# Altium schematic sheet 04_Connector.SchDoc
size A4; SheetNumber: 4; SheetTotal: 4
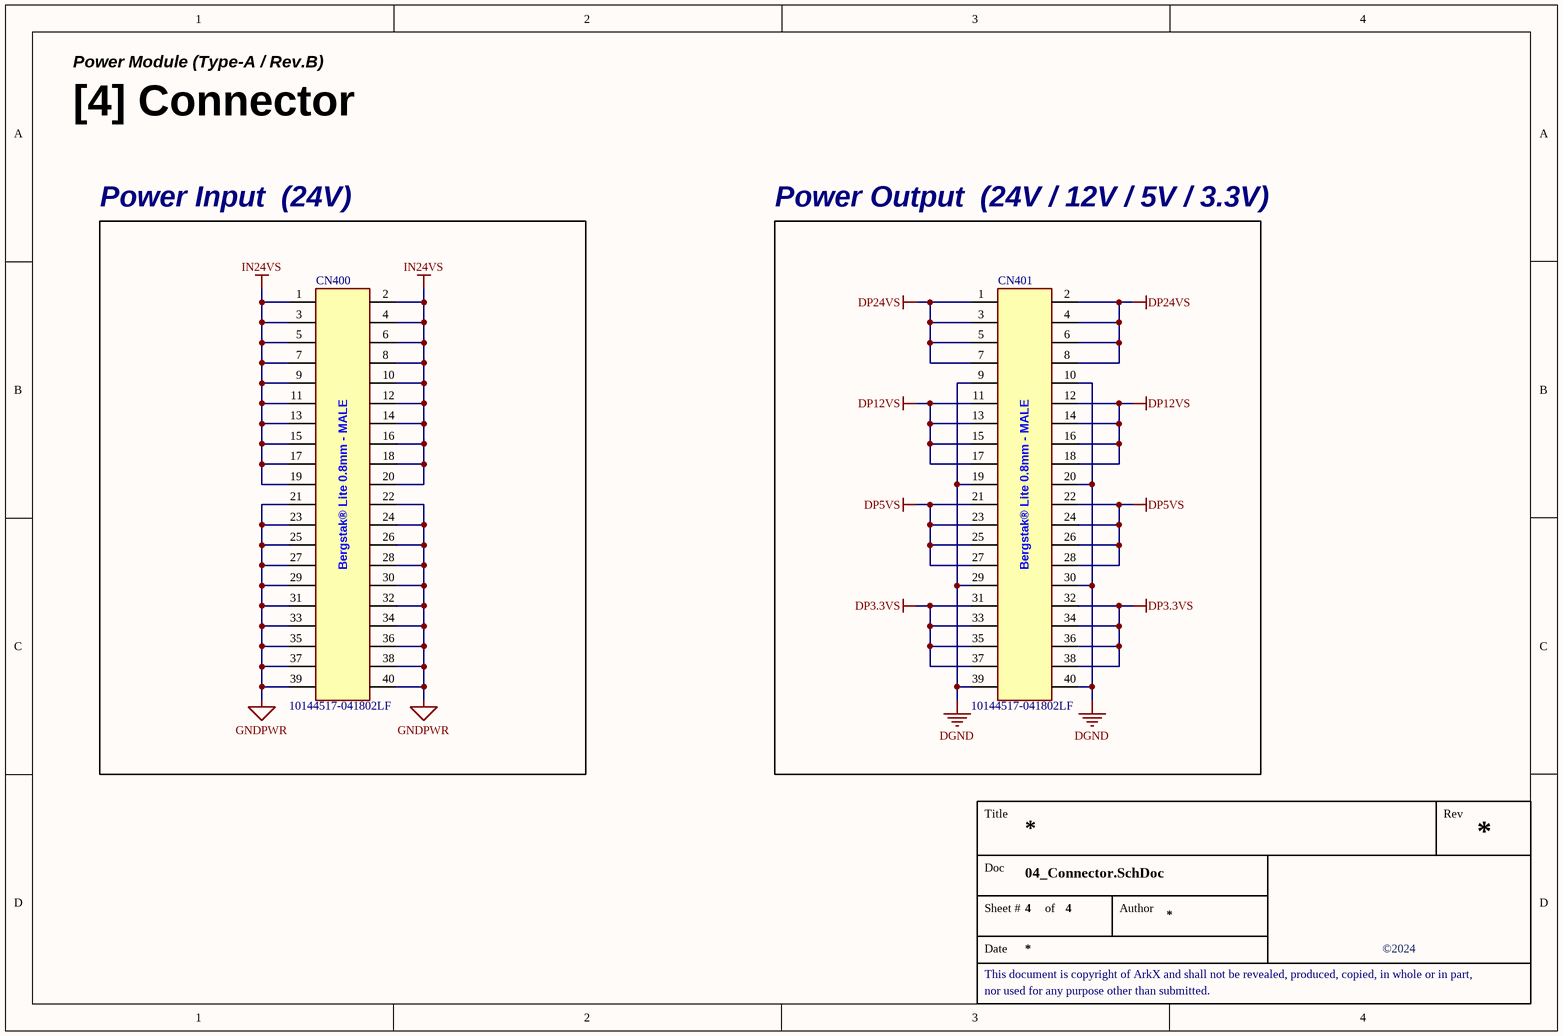
[diagram p0: 04_Connector.SchDoc]

## Parts
CN400  10144517-041802LF  [CON_BergStak-Lite(0.8mm)_MALE-40P(10144517-041802LF)_HandSolder]
CN401  10144517-041802LF  [CON_BergStak-Lite(0.8mm)_MALE-40P(10144517-041802LF)_HandSolder]

## Blocks framed on the sheet
Power Input  (24V): CN400
Power Output  (24V / 12V / 5V / 3.3V): CN401

## Nets
DGND: CN401.9 CN401.10 CN401.19 CN401.20 CN401.29 CN401.30 CN401.39 CN401.40
DP3.3VS: CN401.31 CN401.32 CN401.33 CN401.34 CN401.35 CN401.36 CN401.37 CN401.38
DP5VS: CN401.21 CN401.22 CN401.23 CN401.24 CN401.25 CN401.26 CN401.27 CN401.28
DP12VS: CN401.11 CN401.12 CN401.13 CN401.14 CN401.15 CN401.16 CN401.17 CN401.18
DP24VS: CN401.1 CN401.2 CN401.3 CN401.4 CN401.5 CN401.6 CN401.7 CN401.8
GNDPWR: CN400.21 CN400.22 CN400.23 CN400.24 CN400.25 CN400.26 CN400.27 CN400.28 CN400.29 CN400.30 CN400.31 CN400.32 CN400.33 CN400.34 CN400.35 CN400.36 CN400.37 CN400.38 CN400.39 CN400.40
IN24VS: CN400.1 CN400.2 CN400.3 CN400.4 CN400.5 CN400.6 CN400.7 CN400.8 CN400.9 CN400.10 CN400.11 CN400.12 CN400.13 CN400.14 CN400.15 CN400.16 CN400.17 CN400.18 CN400.19 CN400.20

## Notes on the sheet
- Power Module (Type-A / Rev.B)
- [4] Connector
- Title
- Rev
- Doc
- Sheet #
- of
- Author
- This document is copyright of ArkX and shall not be revealed, produced, copied, in whole or in part,
- Date
- ©2024
- nor used for any purpose other than submitted.
- (in symbol CON_BergStak-Lite(0.8mm)_MALE-40P(10144517-041802LF)) Bergstak® Lite 0.8mm - MALE

## Library data of the parts
CN400 CN401 = CON_BergStak-Lite(0.8mm)_MALE-40P(10144517-041802LF): JLCPCB Part Type: Extended Part